# Altium schematic sheet Fonte.SchDoc
size A4
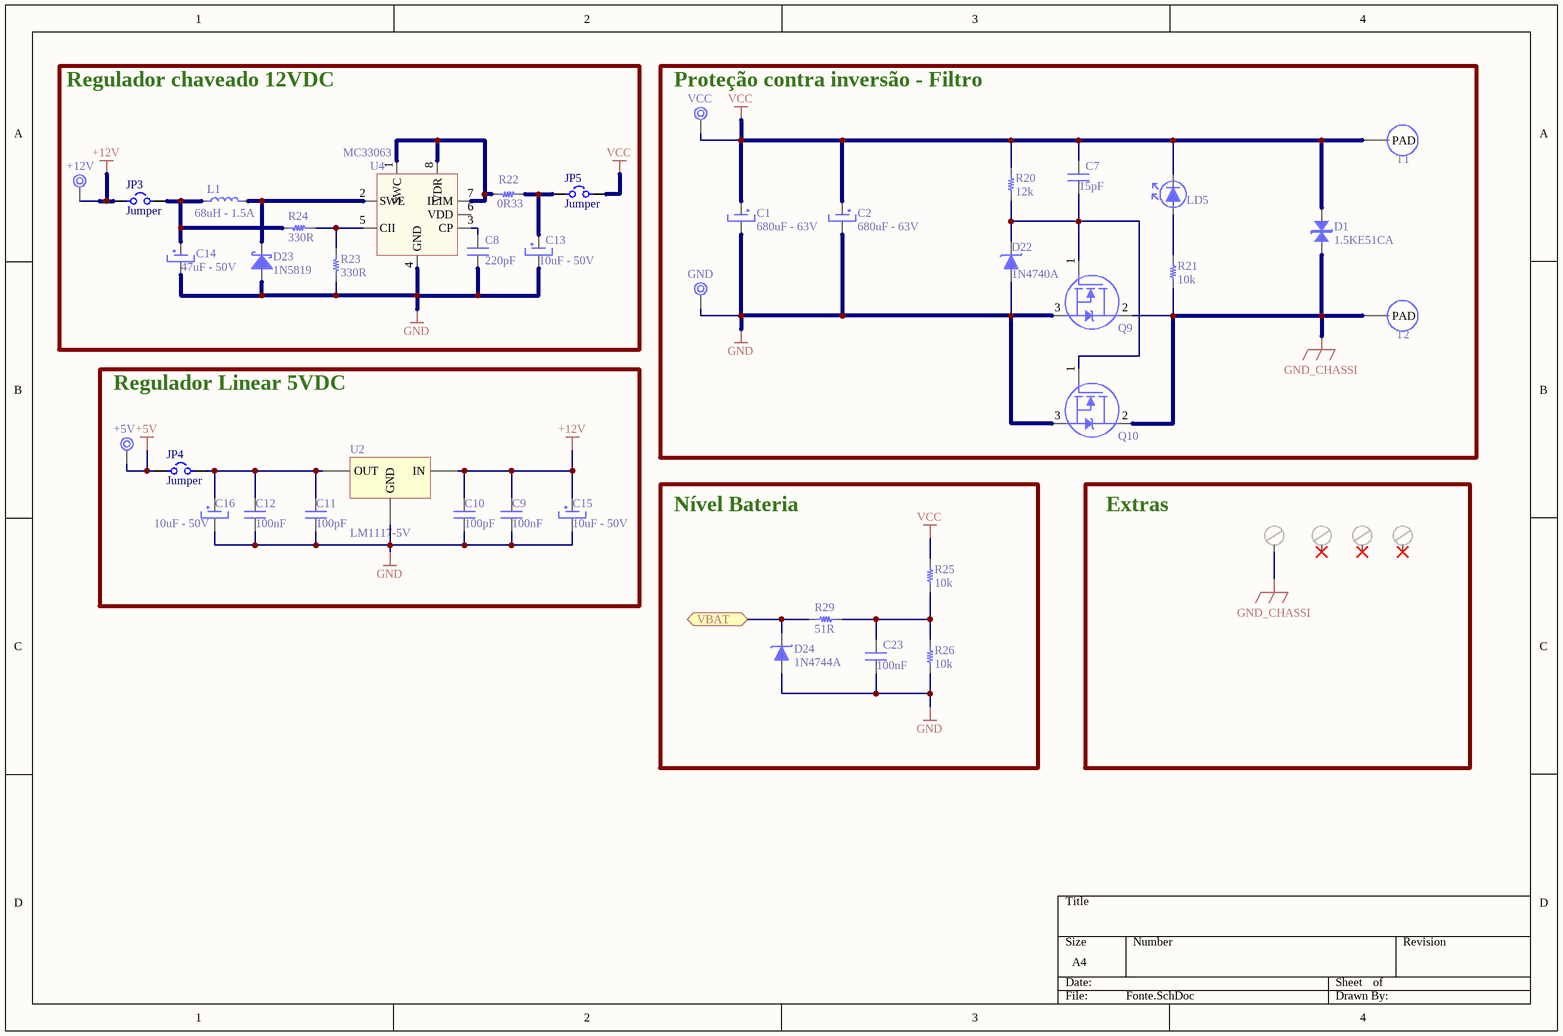
[diagram p0: Fonte.SchDoc]

## Parts
+5V  +5V  [TEST_POINT]  (value not drawn)
+12V  +12V  [TEST_POINT]  (value not drawn)
C1  680uF - 63V  [Capacitor_PHT_filter]
C2  680uF - 63V  [Capacitor_PHT_filter]
C7  15pF  [Capacitor_0805]
C8  220pF  [Capacitor_0805]
C9  100nF  [Capacitor_0805]
C10  100pF  [Capacitor_0805]
C11  100pF  [Capacitor_0805]
C12  100nF  [Capacitor_0805]
C13  10uF - 50V  [CAP_10x20mm]
C14  47uF - 50V  [CAP_10x20mm]
C15  10uF - 50V  [CAP_10x20mm]
C16  10uF - 50V  [CAP_10x20mm]
C23  100nF  [Capacitor_0805]
D1  1.5KE51CA  [DO-201]
D22  1N4740A  [Diode_PHT]
D23  1N5819  [Diode_PHT]
D24  1N4744A  [Diode_PHT]
GND  GND  [TEST_POINT]  (value not drawn)
JP3  Jumper  [JUMPER]
JP4  Jumper  [JUMPER]
JP5  Jumper  [JUMPER]
L1  68uH - 1.5A  [Indutor_5mm]
LD5  Led  [Led 5mm]  (value not drawn)
PF1  Screw M3  [Screw M3]  (value not drawn)
PF2  Screw M3  [Screw M3]  (value not drawn)
PF3  Screw M3  [Screw M3]  (value not drawn)
PF4  Screw M3  [Screw M3]  (value not drawn)
Q9  IRF1405  [TO-220AB]  (value not drawn)
Q10  IRF1405  [TO-220AB]  (value not drawn)
R20  12k  [R_0805]
R21  10k  [R_0805]
R22  0R33  [Resistor_PTH]
R23  330R  [R_0805]
R24  330R  [R_0805]
R25  10k  [R_0805]
R26  10k  [R_0805]
R29  51R  [R_0805]
T1  Power_Pad  [Power_Pad]  (value not drawn)
T2  Power_Pad  [Power_Pad]  (value not drawn)
U2  LM1117-5V  [TO-252]
U4  MC33063  [DIP-8]
VCC  VCC  [TEST_POINT]  (value not drawn)

## Blocks framed on the sheet
Regulador chaveado 12VDC: +12V C8 C13 C14 D23 JP3 JP5 L1 R22-R24 U4
Proteção contra inversão - Filtro: C1 C2 C7 D1 D22 GND LD5 Q9 Q10 R20 R21 T1 T2 VCC
Regulador Linear 5VDC: +5V C9-C12 C15 C16 JP4 U2
Nível Bateria: C23 D24 R25 R26 R29
Extras: PF1-PF4

## Ports
VBAT (bidir)

## Nets
+5V: +5V.1 JP4.1
+12V: +12V.1 C9.2 C10.2 C15.1 JP3.1 U2.3(IN)
GND: C1.1 C2.1 C8.1 C9.1 C10.1 C11.1 C12.1 C13.2 C14.2 C15.2 C16.2 C23.1 D22.A(Anodo) D23.A(Anodo) D24.A(Anodo) GND.1 Q9.3(Source) Q10.3(Source) R23.1 R26.1 U2.1(GND) U4.4(GND)
GND_CHASSI: D1.A(Anodo) PF2.1 Q9.2(Drain) Q10.2(Drain) R21.1 T2.1(PAD)
VCC: C1.2 C2.2 C7.2 D1.K(Catodo) JP5.2 LD5.1(Catodo) R20.2 R25.2 T1.1(PAD) VCC.1
VBAT: D24.K(Catodo) R29.2 ; port VBAT
NetC7_1: C7.1 D22.K(Catodo) Q9.1(Gate) Q10.1(Gate) R20.1
NetC8_2: C8.2 U4.3(CP)
NetC11_2: C11.2 C12.2 C16.1 JP4.2 U2.4(OUT)
NetC13_1: C13.1 JP5.1 R22.1
NetC14_1: C14.1 JP3.2 L1.1 R24.1
NetC23_2: C23.2 R25.1 R26.2 R29.1
NetD23_K: D23.K(Catodo) L1.2 U4.2(SWE)
NetLD5_2: LD5.2(Anodo) R21.2
NetR22_2: R22.2 U4.1(SWC) U4.7(ILIM) U4.8(VDR)
NetR23_2: R23.2 R24.2 U4.5(CII)

Not connected (* = marked no-connect by the designer): PF1 1*; PF3 1*; PF4 1*; U4 6(VDD)

## Library data of the parts
+5V +12V GND VCC = test_point
C1 C2 = 680uF - 63V: Capacitor_680uF_63V; ComponentLink1Description: Datasheet; ComponentLink1URL: https://industrial.panasonic.com/cdbs/www-data/pdf/RDF0000/ABA0000C1209.pdf; Supplier 2: Mouser; Supplier Part Number 1: P11276-ND; Supplier Part Number 2: 667-EEU-FC1J681S; Supplier 1: Digi-Key
C7 = Cap0805_100nF: Capacitor C0805 15pF
C8 = Cap0805_220pF: Capacitor C0805 100nF Desacoplamento
C9 C12 C23 = Cap0805_100nF: Capacitor C0805 100nF Desacoplamento
C10 C11 = Cap0805_100nF: Capacitor C0805 100pF Desacoplamento
C13 C15 C16 = 10uF - 50V: Capacitor_10uF_50V; ComponentLink1Description: Datasheet; ComponentLink1URL: https://industrial.panasonic.com/cdbs/www-data/pdf/RDF0000/ABA0000C1209.pdf; Supplier 2: Mouser; Supplier Part Number 1: P11276-ND; Supplier Part Number 2: 667-EEU-FC1J681S; Supplier 1: Digi-Key
C14 = 47uF - 50V: Capacitor_47uF_50V; ComponentLink1Description: Datasheet; ComponentLink1URL: https://industrial.panasonic.com/cdbs/www-data/pdf/RDF0000/ABA0000C1209.pdf; Supplier 2: Mouser; Supplier Part Number 1: P11276-ND; Supplier Part Number 2: 667-EEU-FC1J681S; Supplier 1: Digi-Key
D1 = 1.5KE51CA: Transzorb; Supplier Part Number 1: 576-1.5KE51CA; Supplier 1: Mouser
D22 = 1N4740A: Diodo Zener 10V 200mA; ComponentLink1Description: Datasheet; ComponentLink1URL: https://www.diodes.com/assets/Datasheets/ds25002.pdf; Supplier 1: Mouser; Supplier Part Number 1: 821-1N4744A
D23 = 1N5819: Diodo Schottky 40V - 1A; Supplier 1: Digi-Key; Supplier Part Number 1: 497-2508-1-ND
D24 = 1N4744A: Diodo Zener 15V 200mA; ComponentLink1Description: Datasheet; ComponentLink1URL: https://www.diodes.com/assets/Datasheets/ds25002.pdf; Supplier 1: Mouser; Supplier Part Number 1: 821-1N4744A
JP3-JP5 = Jumper: Jumper de solda
L1 = Indutor_Genérico: Indutor Genérico PTH 5mm
LD5 = Led: Led padrão PTH ou SMD
Q9 Q10 = IRF1405: MOSFET transistor; Supplier 1: Digi-Key; Supplier 2: Mouser; Supplier Part Number 1: IRF1405PBF-ND; Supplier Part Number 2: 942-IRF1405PBF; ComponentLink1Description: Datasheet; ComponentLink1URL: https://www.infineon.com/dgdl/irf1405pbf.pdf?fileId=5546d462533600a4015355db084a18bb
R20 = Resistor_12K: Resistor padrão 0805; Supplier 1: Mouser; Supplier 2: Digi-Key; Supplier Part Number 1: 603-RC0805FR-0710KL; Supplier Part Number 2: 311-10.0KCRCT-ND
R21 R25 R26 R29 = Resistor_10K: Resistor padrão 0805; Supplier 1: Mouser; Supplier 2: Digi-Key; Supplier Part Number 1: 603-RC0805FR-0710KL; Supplier Part Number 2: 311-10.0KCRCT-ND
R22 = Resistor_Shunt_0R33: Resistor PHT; Supplier 1: Newark; Supplier Part Number 1: 78R4744
R23 R24 = Resistor_330R: Resistor padrão 0805; Supplier 1: Digi-Key; Supplier Part Number 1: 541-150ADKR-ND
T1 T2 = Power_Pad: Terminal de alta potência para soldar os cabos de potência
U2 = LM1117-3V3: LM1117/LM1117I 800mA Low-Dropout Linear Regulator; Supplier Part Number 1: 926-LM1117IDTX-33; Supplier 1: Mouser; ComponentLink1Description: Datasheet LM1117-3.3; ComponentLink1URL: http://www.ti.com/lit/ds/symlink/lm1117.pdf
U4 = MC33063: 1.5-A Peak Boost/Buck/Inverting Switching Regulators; ComponentLink1Description: Datasheet Link; ComponentLink1URL: http://www.ti.com/lit/ds/symlink/mc33063a.pdf